# Altium project RES 2.0 transmitter.PrjPCB
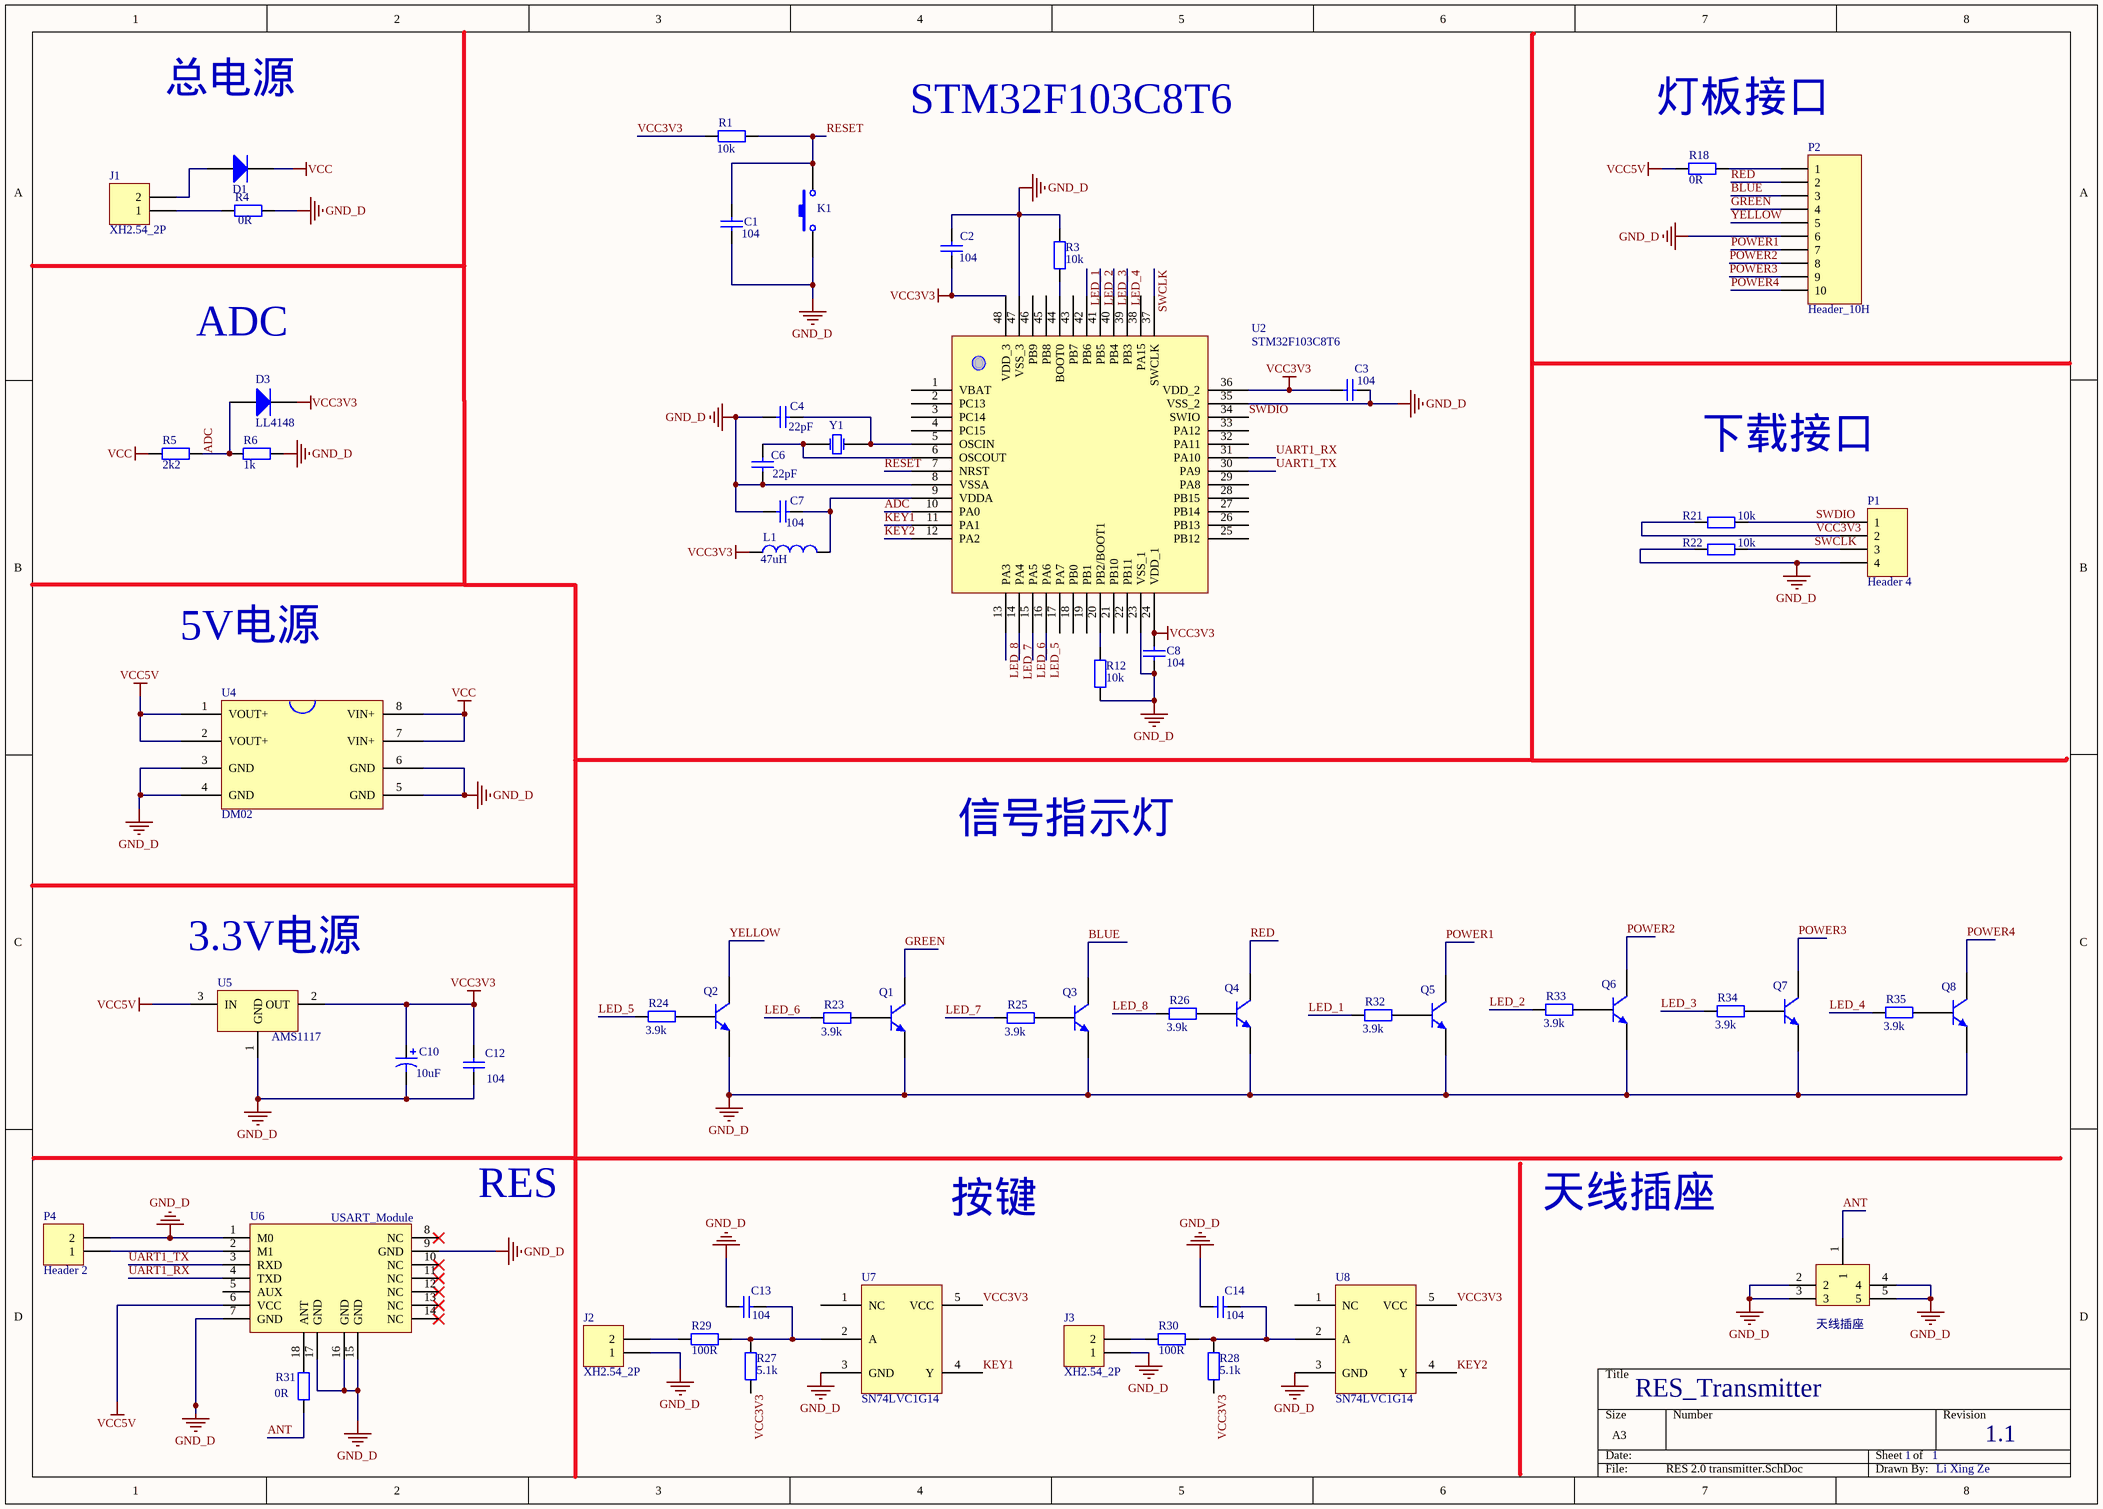
[diagram p0: RES 2.0 transmitter.SchDoc]
1 sheet, 59 parts. Net scope: global (net labels, ports and power ports of the same name join across sheets).
Board file: RES 2.0 transmitter.PcbDoc

## Sheet RES 2.0 transmitter.SchDoc
size A3; DrawnBy: Li Xing Ze

### Parts
C1  value 104  [C 0805]  (hidden comment: Cap vol)
C2  value 104  [C 0805]  (hidden comment: Cap vol)
C3  value 104  [C 0805]  (hidden comment: Cap vol)
C4  value 22pF  [C 0805]  (hidden comment: Cap vol)
C6  value 22pF  [C 0805]  (hidden comment: Cap vol)
C7  value 104  [C 0805]  (hidden comment: Cap vol)
C8  value 104  [C 0805]  (hidden comment: Cap vol)
C10  value 10uF  [CP 3528B]  (hidden comment: Cap vol)
C12  value 104  [C 0805]  (hidden comment: Cap vol)
C13  value 104  [C 0805]  (hidden comment: Cap vol)
C14  value 104  [C 0805]  (hidden comment: Cap vol)
D1  SS14  [DO-214]  (value not drawn)
D3  LL4148  [LL34]
J1  XH2.54_2P  [XH2.54_2P_SMT]
J2  XH2.54_2P  [XH2.54_2P_SMT]
J3  XH2.54_2P  [XH2.54_2P_SMT]
K1  Key  [KEY 3.6*2.5 SMD]  (value not drawn)
L1  value 47uH  [L 0805]  (hidden comment: Inductor)
P1  Header 4  [HDR1X4]
P2  Header_10H  [Header_10H]
P3  天线插座  [ANT]
P4  Header 2  [HDR1X2]
Q1  Model  [SOT23-3]  (value not drawn)
Q2  Model  [SOT23-3]  (value not drawn)
Q3  Model  [SOT23-3]  (value not drawn)
Q4  Model  [SOT23-3]  (value not drawn)
Q5  Model  [SOT23-3]  (value not drawn)
Q6  Model  [SOT23-3]  (value not drawn)
Q7  Model  [SOT23-3]  (value not drawn)
Q8  Model  [SOT23-3]  (value not drawn)
R1  value 10k  [R 0805]  (hidden comment: Res)
R3  value 10k  [R 0805]  (hidden comment: Res)
R4  value 0R  [R 1206]  (hidden comment: Res)
R5  value 2k2  [R 0805]  (hidden comment: Res)
R6  value 1k  [R 0805]  (hidden comment: Res)
R12  value 10k  [R 0805]  (hidden comment: Res)
R18  value 0R  [R 0805]  (hidden comment: Res)
R21  value 10k  [R 0805]  (hidden comment: Res)
R22  value 10k  [R 0805]  (hidden comment: Res)
R23  value 3.9k  [R 0805]  (hidden comment: Res)
R24  value 3.9k  [R 0805]  (hidden comment: Res)
R25  value 3.9k  [R 0805]  (hidden comment: Res)
R26  value 3.9k  [R 0805]  (hidden comment: Res)
R27  value 5.1k  [R 0805]  (hidden comment: Res)
R28  value 5.1k  [R 0805]  (hidden comment: Res)
R29  value 100R  [R 0805]  (hidden comment: Res)
R30  value 100R  [R 0805]  (hidden comment: Res)
R31  value 0R  [R 0805]  (hidden comment: Res2)
R32  value 3.9k  [R 0805]  (hidden comment: Res)
R33  value 3.9k  [R 0805]  (hidden comment: Res)
R34  value 3.9k  [R 0805]  (hidden comment: Res)
R35  value 3.9k  [R 0805]  (hidden comment: Res)
U2  STM32F103C8T6  [LQFP48]
U4  DM02  [DM02]
U5  AMS1117  [SOT223]
U6  USART_Module  [USART_Module]
U7  SN74LVC1G14  [SOT23-5]
U8  SN74LVC1G14  [SOT23-5]
Y1  Freq  [XTAL-5032]  (value not drawn)

### Nets
GND_D: C1.1 C2.2 C3.2 C4.1 C6.1 C7.1 C8.1 C10.2 C12.1 C13.1 C14.1 J2.1 J3.1 K1.1 P1.4 P2.6 P3.2 P3.3 P3.4 P3.5 P4.2 Q1.2(E) Q2.2(E) Q3.2(E) Q4.2(E) Q5.2(E) Q6.2(E) Q7.2(E) Q8.2(E) R3.2 R4.2 R6.1 R12.1 R22.2 U2.8(VSSA) U2.23(VSS_1) U2.35(VSS_2) U2.47(VSS_3) U4.3(GND) U4.4(GND) U4.5(GND) U4.6(GND) U5.1(GND) U6.1(M0) U6.7(GND) U6.9(GND) U6.15(GND) U6.16(GND) U6.17(GND) U7.3(GND) U8.3(GND)
VCC: D1.2(K) R5.2 U4.7(VIN+) U4.8(VIN+)
VCC3V3: C2.1 C3.1 C8.2 C10.1 C12.2 D3.2(K) L1.1 P1.2 R1.2 R21.2 R27.1 R28.1 U2.24(VDD_1) U2.36(VDD_2) U2.48(VDD_3) U5.2(OUT) U7.5(VCC) U8.5(VCC)
VCC5V: R18.2 U4.1(VOUT+) U4.2(VOUT+) U5.3(IN) U6.6(VCC)
ADC: D3.1(A) R5.1 R6.2 U2.10(PA0)
ANT: P3.1 R31.1
BLUE: P2.3 Q3.3(C)
GREEN: P2.4 Q1.3(C)
KEY1: U2.11(PA1) U7.4(Y)
KEY2: U2.12(PA2) U8.4(Y)
LED_1: R32.2 U2.42(PB6)
LED_2: R33.2 U2.41(PB5)
LED_3: R34.2 U2.40(PB4)
LED_4: R35.2 U2.39(PB3)
LED_5: R24.2 U2.16(PA6)
LED_6: R23.2 U2.15(PA5)
LED_7: R25.2 U2.14(PA4)
LED_8: R26.2 U2.13(PA3)
POWER1: P2.7 Q5.3(C)
POWER2: P2.8 Q6.3(C)
POWER3: P2.9 Q7.3(C)
POWER4: P2.10 Q8.3(C)
RED: P2.2 Q4.3(C)
RESET: C1.2 K1.2 R1.1 U2.7(NRST)
SWCLK: P1.3 R22.1 U2.37(SWCLK)
SWDIO: P1.1 R21.1 U2.34(SWIO)
UART1_RX: U2.31(PA10) U6.4(TXD)
UART1_TX: U2.30(PA9) U6.3(RXD)
YELLOW: P2.5 Q2.3(C)
NetC4_2: C4.2 U2.5(OSCIN) Y1.2(OSC2)
NetC6_2: C6.2 U2.6(OSCOUT) Y1.1(OSC1)
NetC7_2: C7.2 L1.2 U2.9(VDDA)
NetC13_2: C13.2 R27.2 R29.1 U7.2(A)
NetC14_2: C14.2 R28.2 R30.1 U8.2(A)
NetD1_1: D1.1(A) J1.2
NetJ1_1: J1.1 R4.1
NetJ2_2: J2.2 R29.2
NetJ3_2: J3.2 R30.2
NetP2_1: P2.1 R18.1
NetP4_1: P4.1 U6.2(M1)
NetQ1_1: Q1.1(B) R23.1
NetQ2_1: Q2.1(B) R24.1
NetQ3_1: Q3.1(B) R25.1
NetQ4_1: Q4.1(B) R26.1
NetQ5_1: Q5.1(B) R32.1
NetQ6_1: Q6.1(B) R33.1
NetQ7_1: Q7.1(B) R34.1
NetQ8_1: Q8.1(B) R35.1
NetR3_1: R3.1 U2.44(BOOT0)
NetR12_2: R12.2 U2.20(PB2/BOOT1)
NetR31_2: R31.2 U6.18(ANT)

Not connected (* = marked no-connect by the designer): U2 1(VBAT) 2(PC13) 3(PC14) 4(PC15) 17(PA7) 18(PB0) 19(PB1) 21(PB10) 22(PB11) 25(PB12) 26(PB13) 27(PB14) 28(PB15) 29(PA8) 32(PA11) 33(PA12) 38(PA15) 43(PB7) 45(PB8) 46(PB9); U6 5(AUX) 8(NC)* 10(NC)* 11(NC)* 12(NC)* 13(NC)* 14(NC)*; U7 1(NC); U8 1(NC)

### Notes on the sheet
- 总电源
- STM32F103C8T6
- (near R18) 灯板接口
- ADC
- 下载接口
- 5V电源
- 信号指示灯
- (near U5) 3.3V电源
- RES
- 按键
- 天线插座
- RES_Transmitter
- 1
- 1.1

### Library data of the parts
C1-C4 C6-C8 C12-C14 = Cap: 无极性电容
C10 = Cap_Pol: 极性电容
D1 = Diode: 肖特基（快恢复）二极管
D3 = Diode: 开关二极管
J1 = XH2.54_2P: XH2.54Header,2-pin
K1 = Key: 按键
L1 = Inductor: 电感
P1 = Header 4: Header, 4-Pin; LatestRevisionDate: 17-Jul-2002; LatestRevisionNote: Re-released for DXP Platform.; Publisher: Altium Limited
P4 = Header 2: Header, 2-Pin; LatestRevisionDate: 17-Jul-2002; LatestRevisionNote: Re-released for DXP Platform.; Publisher: Altium Limited
Q1-Q8 = Transistor_NPN: NPN三极管
R1 R3-R6 R12 R18 R21-R30 R32-R35 = Resistor: 电阻
R31 = Res2: Resistor; Published: 8-Jun-2000; LatestRevisionDate: 17-Jul-2002; LatestRevisionNote: Re-released for DXP Platform.; PackageReference: AXIAL-0.4; Publisher: Altium Limited; PackageDescription: Axial Device, Thru-Hole; 2 Leads; 0.4 in Pin Spacing
U2 = STM32F103C8T6: Micro controller
U4 = DM02: 开关型DC-DC变换器
U5 = AMS1117: 线性稳压器
U6 = RES
U7 U8 = SN74LVC1G14: 单路施密特反相器
Y1 = XTAL: 晶振